# Altium schematic sheet USB_FIFO.SchDoc
size A4; SheetNumber: 3; SheetTotal: 8
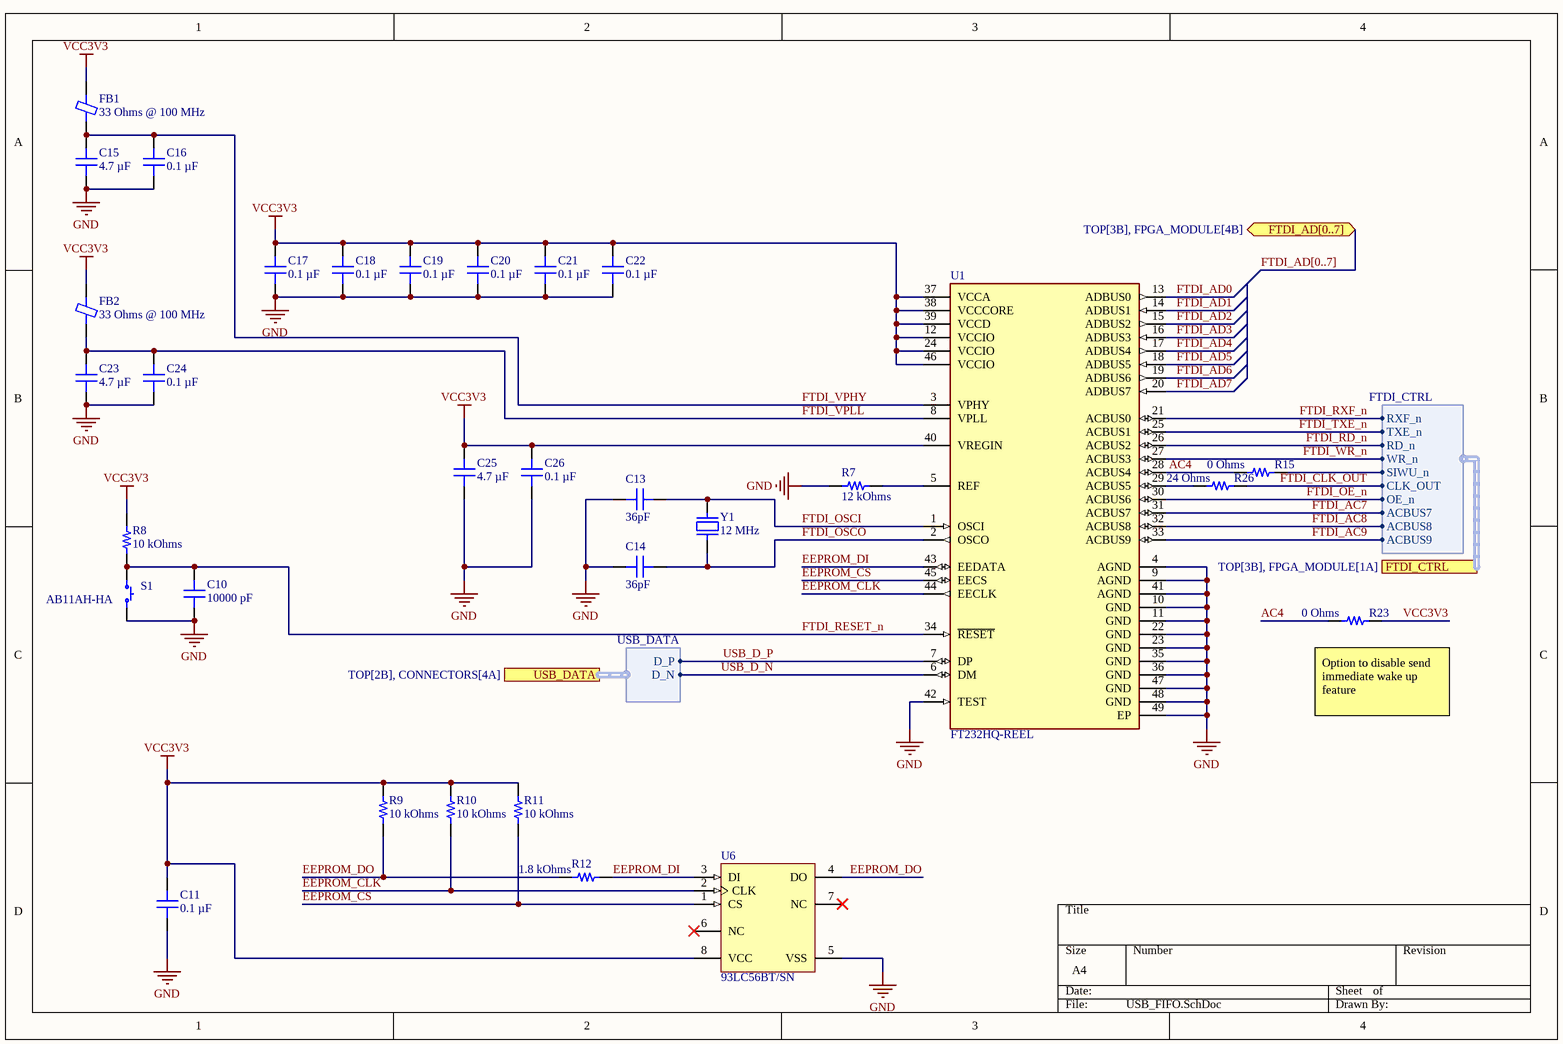
[diagram p0: USB_FIFO.SchDoc]

## Parts
C10  10000 pF  [CAP 0402_1005]
C11  0.1 µF  [CAP 0402_1005]
C13  36pF  [CAP 0603_1608]
C14  36pF  [CAP 0603_1608]
C15  4.7 µF  [CAP 0402_1005]
C16  0.1 µF  [CAP 0402_1005]
C17  0.1 µF  [CAP 0402_1005]
C18  0.1 µF  [CAP 0402_1005]
C19  0.1 µF  [CAP 0402_1005]
C20  0.1 µF  [CAP 0402_1005]
C21  0.1 µF  [CAP 0402_1005]
C22  0.1 µF  [CAP 0402_1005]
C23  4.7 µF  [CAP 0402_1005]
C24  0.1 µF  [CAP 0402_1005]
C25  4.7 µF  [CAP 0402_1005]
C26  0.1 µF  [CAP 0402_1005]
FB1  33 Ohms @ 100 MHz  [FER 0201_0603]
FB2  33 Ohms @ 100 MHz  [FER 0201_0603]
R7  12 kOhms  [RES 0402_1005]
R8  10 kOhms  [RES 0402_1005]
R9  10 kOhms  [RES 0402_1005]
R10  10 kOhms  [RES 0402_1005]
R11  10 kOhms  [RES 0402_1005]
R12  1.8 kOhms  [RES 0402_1005]
R15  0 Ohms  [RES 0603_1608]
R23  0 Ohms  [RES 0603_1608]
R26  24 Ohms  [RES 0402_1005]
S1  AB11AH-HA  [NKK AB11AH-HA]
U1  FT232HQ-REEL  [FP-QFN-48-MFG]
U6  93LC56BT/SN  [SOIC-SN8_M]
Y1  12 MHz  [ABRACON ABLS]

## Ports
FTDI_AD[0..7] (bidir, see TOP[3B], FPGA_MODULE[4B]), FTDI_CTRL (harness FTDI_CTRL, see TOP[3B], FPGA_MODULE[1A]), USB_DATA (harness USB_DATA, see TOP[2B], CONNECTORS[4A])

## Harnesses
USB_DATA: D_N, D_P
FTDI_CTRL: RXF_n, TXE_n, RD_n, WR_n, CLK_OUT, OE_n, ACBUS7, ACBUS8, ACBUS9, SIWU_n

## Nets
GND: C10.1 C11.1 C13.1 C14.1 C15.1 C16.1 C17.1 C18.1 C19.1 C20.1 C21.1 C22.1 C23.1 C24.1 C25.1 C26.1 R7.1 S1.1 U1.4(AGND) U1.9(AGND) U1.10(GND) U1.11(GND) U1.22(GND) U1.23(GND) U1.35(GND) U1.36(GND) U1.41(AGND) U1.42(TEST) U1.47(GND) U1.48(GND) U1.49(EP) U6.5(VSS)
VCC3V3: C11.2 C17.2 C18.2 C19.2 C20.2 C21.2 C22.2 C25.2 C26.2 FB1.2 FB2.2 R8.2 R9.2 R10.2 R11.2 R23.2 U1.12(VCCIO) U1.24(VCCIO) U1.37(VCCA) U1.38(VCCCORE) U1.39(VCCD) U1.40(VREGIN) U1.46(VCCIO) U6.8(VCC)
AC4: R15.1 R23.1 U1.28(ACBUS4)
EEPROM_CLK: R10.1 U1.44(EECLK) U6.2(CLK)
EEPROM_CS: R11.1 U1.45(EECS) U6.1(CS)
EEPROM_DI: R12.2 U1.43(EEDATA) U6.3(DI)
EEPROM_DO: R9.1 R12.1 U6.4(DO)
FTDI_AC7: U1.31(ACBUS7) ; port FTDI_CTRL.ACBUS7
FTDI_AC8: U1.32(ACBUS8) ; port FTDI_CTRL.ACBUS8
FTDI_AC9: U1.33(ACBUS9) ; port FTDI_CTRL.ACBUS9
FTDI_AD0: U1.13(ADBUS0)
FTDI_AD1: U1.14(ADBUS1)
FTDI_AD2: U1.15(ADBUS2)
FTDI_AD3: U1.16(ADBUS3)
FTDI_AD4: U1.17(ADBUS4)
FTDI_AD5: U1.18(ADBUS5)
FTDI_AD6: U1.19(ADBUS6)
FTDI_AD7: U1.20(ADBUS7)
FTDI_CLK_OUT: R26.2 ; port FTDI_CTRL.CLK_OUT
FTDI_OE_n: U1.30(ACBUS6) ; port FTDI_CTRL.OE_n
FTDI_OSCI: C13.2 U1.1(OSCI) Y1.2
FTDI_OSCO: C14.2 U1.2(OSCO) Y1.1
FTDI_RD_n: U1.26(ACBUS2) ; port FTDI_CTRL.RD_n
FTDI_RESET_n: C10.2 R8.1 S1.3 U1.34(~{RESET})
FTDI_RXF_n: U1.21(ACBUS0) ; port FTDI_CTRL.RXF_n
FTDI_TXE_n: U1.25(ACBUS1) ; port FTDI_CTRL.TXE_n
FTDI_VPHY: C15.2 C16.2 FB1.1 U1.3(VPHY)
FTDI_VPLL: C23.2 C24.2 FB2.1 U1.8(VPLL)
FTDI_WR_n: U1.27(ACBUS3) ; port FTDI_CTRL.WR_n
USB_D_N: U1.6(DM) ; port USB_DATA.D_N
USB_D_P: U1.7(DP) ; port USB_DATA.D_P
NetR7_2: R7.2 U1.5(REF)
NetR15_2: R15.2 ; port FTDI_CTRL.SIWU_n
NetR26_1: R26.1 U1.29(ACBUS5)

Not connected (* = marked no-connect by the designer): U6 6(NC)* 7(NC)*

## Buses and harness runs
bus FTDI_AD[0..7] = port FTDI_AD[0..7]

## Notes on the sheet
- (near R23) Option to disable send immediate wake up feature

## Library data of the parts
C10 = HMK105B7103KVHFE: CAP MLCC 0.01UF 100V X7R 0402; manufacturer: Taiyo Yuden; Tolerance: ±10%; Part Number: HMK105B7103KVHFE; Value: 10000 pF; Applications: Automotive, SMPS Filtering; Capacitance: 10000 pF; componentlink1description: Datasheet; componentlink1url: https://ds.yuden.co.jp/TYCOMPAS/ut/detail?pn=HMK105B7103KVHFE&u=M; componentlink2description: DigiKey Link; componentlink2url: https://www.digikey.com/en/products/detail/taiyo-yuden/HMK105B7103KVHFE/11687483; Device Package: 0402 (1005 Metric); lastupdated: 2022-07-15 11:24:57 AM; Lifecycle Status: Active; Minimum Order: 1; Mounting Type: Surface Mount, MLCC; Operating Temperature: -55°C ~ 125°C; Package / Case: 0402 (1005 Metric); packaging: TapeAndReel; partid: 41784; Part Status: Active; price: 0.02; Ratings: AEC-Q200; series: M; Size / Dimension: 0.039" L x 0.020" W (1.00mm x 0.50mm); Supplier 1: DigiKey; Supplier Part Number 1: 587-HMK105B7103KVHFECT-ND; Temperature Coefficient: X7R; Thickness (Max): 0.022" (0.55mm); Voltage - Rated: 100V
C11 C16-C22 C24 C26 = CGA2B3X5R1H104M050BB: CAP CER 0.1UF 50V X5R 0402; manufacturer: TDK Corporation; Tolerance: ±20%; Part Number: CGA2B3X5R1H104M050BB; Value: 0.1 µF; Applications: Automotive; Capacitance: 0.1 µF; componentlink1description: Datasheet; componentlink1url: https://product.tdk.com/info/en/catalog/datasheets/mlcc_automotive_general_en.pdf?ref_disty=digikey; componentlink2description: DigiKey Link; componentlink2url: https://www.digikey.com/en/products/detail/tdk-corporation/CGA2B3X5R1H104M050BB/3949450; Device Package: 0402 (1005 Metric); Lifecycle Status: Active; Minimum Order: 1; Mounting Type: Surface Mount, MLCC; Operating Temperature: -55°C ~ 85°C; Package / Case: 0402 (1005 Metric); packaging: TapeAndReel; partid: 1792; Part Status: Active; price: 0.02; Ratings: AEC-Q200; series: CGA; Size / Dimension: 0.039" L x 0.020" W (1.00mm x 0.50mm); Supplier 1: DigiKey; Supplier Part Number 1: 445-12214-1-ND; Temperature Coefficient: X5R; Thickness (Max): 0.022" (0.55mm); Voltage - Rated: 50V
  C11: lastupdated: 2022-07-15 11:25:55 AM
  C16-C22 C24 C26: lastupdated: 2022-07-21 3:55:54 AM
C13 C14 = 06031A360JAT2A: CAP CER 36PF 100V NP0 0603; manufacturer: AVX Corporation; Temperature Coefficient: C0G, NP0; Tolerance: ±5%; Part Number: 06031A360JAT2A; Value: 36pF; Applications: General Purpose; Capacitance: 36pF; componentlink1description: Datasheet; componentlink1url: http://datasheets.avx.com/C0GNP0-Dielectric.pdf; componentlink2description: DigiKey Link; componentlink2url: http://digikey.com/product-detail/en/avx-corporation/06031A360JAT2A/478-10202-1-ND/6797206; Device Package: 0603 (1608 Metric); lastupdated: 2020-09-02 1:03:27 AM; Lifecycle Status: Active; Minimum Order: 1; Mounting Type: Surface Mount, MLCC; Operating Temperature: -55°C ~ 125°C; Package / Case: 0603 (1608 Metric); packaging: TapeAndReel; partid: 7331; Part Status: Active; price: 0.04; series: -; Size / Dimension: 0.063" L x 0.032" W (1.60mm x 0.81mm); Supplier 1: DigiKey; Supplier Part Number 1: 478-10202-1-ND; Thickness (Max): 0.035" (0.90mm); Voltage - Rated: 100V
C15 C23 C25 = CL05A475MO5NUNC: CAP CER 4.7UF 16V X5R 0402; manufacturer: Samsung Electro-Mechanics; Tolerance: ±20%; Part Number: CL05A475MO5NUNC; Value: 4.7 µF; Applications: General Purpose; Capacitance: 4.7 µF; componentlink1description: Datasheet; componentlink1url: http://www.samsungsem.com/kr/support/product-search/mlcc/__icsFiles/afieldfile/2019/05/29/Data%20sheet_CL05A475MO5NUNC.pdf; componentlink2description: DigiKey Link; componentlink2url: https://www.digikey.com/en/products/detail/samsung-electro-mechanics/CL05A475MO5NUNC/5961320; Device Package: 0402 (1005 Metric); lastupdated: 2022-07-21 3:55:55 AM; Lifecycle Status: Active; Minimum Order: 1; Mounting Type: Surface Mount, MLCC; Operating Temperature: -55°C ~ 85°C; Package / Case: 0402 (1005 Metric); packaging: TapeAndReel; partid: 1760; Part Status: Active; price: 0.09; series: CL; Size / Dimension: 0.039" L x 0.020" W (1.00mm x 0.50mm); Supplier 1: DigiKey; Supplier Part Number 1: 1276-6836-1-ND; Temperature Coefficient: X5R; Thickness (Max): 0.028" (0.70mm); Voltage - Rated: 16V
FB1 FB2 = MMZ0603F330CT000: FERRITE BEAD 33 OHM 0201 1LN; Manufacturer: TDK Corporation; Current Rating (Max): 150mA; DC Resistance (DCR) (Max): 1.3Ohm; Filter Type: Signal Line; Number of Lines: 1; Part Number: MMZ0603F330CT000; ComponentLink1Description: Datasheet; ComponentLink1URL: https://product.tdk.com/info/en/catalog/datasheets/beads_commercial_signal_mmz0603_en.pdf?ref_disty=digikey; ComponentLink2Description: DigiKey Link; ComponentLink2URL: https://www.digikey.com/en/products/detail/tdk-corporation/MMZ0603F330CT000/2747662; Device Package: 0201 (0603 Metric); Height (Max): 0.013" (0.33mm); Impedance @ Frequency: 33 Ohms @ 100 MHz; LastUpdated: 2022-07-21 4:37:41 AM; Lifecycle Status: Active; Minimum Order: 1; Mounting Type: Surface Mount; Operating Temperature: -55°C ~ 125°C; Package / Case: 0201 (0603 Metric); Packaging: TapeAndReel; PartId: 1; Part Status: Active; Price: 0.03; Series: MMZ; Size / Dimension: 0.024" L x 0.012" W (0.60mm x 0.30mm); Supplier 1: DigiKey; Supplier Part Number 1: 445-7792-1-ND; Value: 33 Ohms @ 100 MHz
R7 = CPF0402B12KE1: RES SMD 12K OHM 0.1% 1/16W 0402; Manufacturer: TE Connectivity Passive Product; Power (Watts): 0.063W, 1/16W; Temperature Coefficient: ±25ppm/°C; Part Number: CPF0402B12KE1; Value: 12 kOhms; ComponentLink1Description: Datasheet; ComponentLink1URL: https://www.te.com/commerce/DocumentDelivery/DDEController?Action=srchrtrv&DocNm=1773200&DocType=DS&DocLang=English; ComponentLink2Description: DigiKey Link; ComponentLink2URL: https://www.digikey.com/en/products/detail/te-connectivity-passive-product/CPF0402B12KE1/2381830; Composition: Thin Film; Device Package: 0402 (1005 Metric); Height - Seated (Max): 0.014" (0.35mm); LastUpdated: 2022-07-15 11:43:11 AM; Lifecycle Status: Active; Minimum Order: 1; Number of Terminations: 2; Operating Temperature: -55°C ~ 155°C; Package / Case: 0402 (1005 Metric); Packaging: TapeAndReel; PartId: 3318; Part Status: Active; Price: 0.15; Resistance: 12 kOhms; Series: CPF, Neohm; Size / Dimension: 0.039" L x 0.020" W (1.00mm x 0.50mm); Supplier 1: DigiKey; Supplier Part Number 1: A102603CT-ND; Supplier Device Package: 0402; Tolerance: ±0.1%
R8-R11 = RP73PF1E10KBTD: RES 10K OHM 0.1% 1/10W 0402; Manufacturer: TE Connectivity Passive Product; Power (Watts): 0.1W, 1/10W; Temperature Coefficient: ±25ppm/°C; Part Number: RP73PF1E10KBTD; Value: 10 kOhms; ComponentLink1Description: Datasheet; ComponentLink1URL: https://www.te.com/commerce/DocumentDelivery/DDEController?Action=srchrtrv&DocNm=1773272&DocType=DS&DocLang=English; ComponentLink2Description: DigiKey Link; ComponentLink2URL: https://www.digikey.com/en/products/detail/te-connectivity-passive-product/RP73PF1E10KBTD/8260957; Composition: Thin Film; Device Package: 0402 (1005 Metric); Height - Seated (Max): 0.014" (0.35mm); LastUpdated: 2022-07-15 11:43:14 AM; Lifecycle Status: Active; Minimum Order: 1; Number of Terminations: 2; Operating Temperature: -55°C ~ 155°C; Package / Case: 0402 (1005 Metric); Packaging: TapeAndReel; PartId: 2434; Part Status: Active; Price: 0.09; Resistance: 10 kOhms; Series: RP73, Holsworthy; Size / Dimension: 0.039" L x 0.020" W (1.00mm x 0.50mm); Supplier 1: DigiKey; Supplier Part Number 1: A127415CT-ND; Supplier Device Package: 0402; Tolerance: ±0.1%
R12 = RC0402FR-071K8L: RES 1.8K OHM 1% 1/16W 0402; Manufacturer: Yageo; Power (Watts): 0.063W, 1/16W; Temperature Coefficient: ±100ppm/°C; Part Number: RC0402FR-071K8L; Value: 1.8 kOhms; ComponentLink1Description: Datasheet; ComponentLink1URL: https://www.yageo.com/upload/media/product/productsearch/datasheet/rchip/PYu-RC_Group_51_RoHS_L_10.pdf; ComponentLink2Description: DigiKey Link; ComponentLink2URL: https://www.digikey.com/en/products/detail/yageo/RC0402FR-071K8L/726520; Composition: Thick Film; Device Package: 0402 (1005 Metric); Features: Moisture Resistant; Height - Seated (Max): 0.016" (0.40mm); LastUpdated: 2022-07-21 4:11:16 AM; Lifecycle Status: Active; Minimum Order: 1; Number of Terminations: 2; Operating Temperature: -55°C ~ 155°C; Package / Case: 0402 (1005 Metric); Packaging: CutTape; PartId: 2542; Part Status: Active; Price: 0.01; Resistance: 1.8 kOhms; Series: RC_L; Size / Dimension: 0.039" L x 0.020" W (1.00mm x 0.50mm); Supplier 1: DigiKey; Supplier Part Number 1: 311-1.80KLRCT-ND; Supplier Device Package: 0402; Tolerance: ±1%
R15 R23 = 5110: RES SMD 0 OHM JUMPER 1/2W 0603; Part Number: 5110; Manufacturer: Keystone Electronics; Power (Watts): 0.5W, 1/2W; Value: 0 Ohms; ComponentLink1Description: Datasheet; ComponentLink1URL: http://keyelco.com/userAssets/file/M65p54.pdf; ComponentLink2Description: DigiKey Link; ComponentLink2URL: https://www.digikey.com/en/products/detail/keystone-electronics/5110/5118870; Composition: Metal Element; Device Package: 0603 (1608 Metric); Height - Seated (Max): 0.028" (0.70mm); LastUpdated: 2022-09-14 8:08:57 AM; Lifecycle Status: Active; Minimum Order: 1; Number of Terminations: 2; Package / Case: 0603 (1608 Metric); Packaging: TapeAndReel; PartId: 20779; Part Status: Active; Price: 0.16; Resistance: 0 Ohms; Series: -; Size / Dimension: 0.061" L x 0.033" W (1.55mm x 0.85mm); Supplier 1: DigiKey; Supplier Part Number 1: 36-5110CT-ND; Supplier Device Package: 0603; Tolerance: Jumper
R26 = RC0402FR-0724RL: RES 24 OHM 1% 1/16W 0402; Manufacturer: Yageo; Power (Watts): 0.063W, 1/16W; Temperature Coefficient: ±100ppm/°C; Part Number: RC0402FR-0724RL; Value: 24 Ohms; ComponentLink1Description: Datasheet; ComponentLink1URL: https://www.yageo.com/upload/media/product/productsearch/datasheet/rchip/PYu-RC_Group_51_RoHS_L_10.pdf; ComponentLink2Description: DigiKey Link; ComponentLink2URL: https://www.digikey.com/en/products/detail/yageo/RC0402FR-0724RL/5280933; Composition: Thick Film; Device Package: 0402 (1005 Metric); Features: Moisture Resistant; Height - Seated (Max): 0.016" (0.40mm); LastUpdated: 2022-09-19 1:15:03 PM; Lifecycle Status: Active; Minimum Order: 1; Number of Terminations: 2; Operating Temperature: -55°C ~ 155°C; Package / Case: 0402 (1005 Metric); Packaging: CutTape; PartId: 2811; Part Status: Active; Price: 0.01; Resistance: 24 Ohms; Series: RC_L; Size / Dimension: 0.039" L x 0.020" W (1.00mm x 0.50mm); Supplier 1: DigiKey; Supplier Part Number 1: YAG3073CT-ND; Supplier Device Package: 0402; Tolerance: ±1%
S1 = AB11AH-HA: SWITCH PUSH SPST-NO 0.4VA 28V; Manufacturer: NKK Switches; Actuator Type: Round, Button; Color - Actuator/Cap: Black; Current Rating (Amps): 0.4VA (AC/DC); Switch Function: Off-Mom; Part Number: AB11AH-HA; Circuit: SPST-NO; ComponentLink1Description: Datasheet; ComponentLink1URL: https://www.nkkswitches.com/pdf/Apushbuttons.pdf; ComponentLink2Description: DigiKey Link; ComponentLink2URL: //digikey.com/product-detail/en/nkk-switches/AB11AH-HA/360-2703-ND/1056050; Features: Sealed - Fully; LastUpdated: 2019-12-12 8:13:11 AM; Lifecycle Status: 0; Minimum Order: 1; Mounting Type: Through Hole, Right Angle; Operating Temperature: -30°C ~ 85°C; Packaging: Tray; Part Status: Active; Price: 5.00; Series: AB; Supplier 1: DigiKey; Supplier Part Number 1: 360-2703-ND; Termination Style: PC Pin; Type: Standard; Voltage Rating - AC: 28V; Voltage Rating - DC: 28V
U1 = CMP-0078-00034-4: IC HS USB TO UART/FIFO 48QFN; Number of Channels: 1; Max Supply Voltage: 3.63V; Min Supply Voltage: 2.97V; Operating Supply Current: 24mA; Data Rate: 12Mbps; Interface: UART; Nominal Supply Current: 60mA; Operating Supply Voltage: 3.3V; Case/Package: QFN; Packaging: Tape and Reel; Weight: 0.005309oz; Number of Pins: 48; REACH SVHC: No SVHC; Length: 7mm; Mount: Surface Mount; Package Quantity: 1; Lead Free: Lead Free; Radiation Hardening: No; Max Operating Temperature: 85°C; Min Operating Temperature: -40°C; Height: 1.4mm; Width: 7mm
U6 = CMP-0162-00132-1: 2K, 128x16-bit, 2.5V Microwire Serial EEPROM, 8-Pin SOIC 150mil, Commercial Temperature, Tape and Reel; ComponentAvailability: Unknown. Contact manufacturer to determine status.; Code_IPC: SOIC127P600-8; PackageReference: SOIC-SN8; Code_JEDEC: MS-012; DatasheetVersion: revF, May-2008; PackageDescription: 8-Lead Plastic Small Outline (SN) - Narrow, 3.90mm Body [SOIC]; PackageVersion: revBB, Aug-2009
Y1 = ABLS-12.000MHZ-20-B-3-H-T: CRYSTAL 12.0000MHZ 20PF SMD; Manufacturer: Abracon LLC; ESR (Equivalent Series Resistance): 50 Ohms; Frequency Stability: ±35ppm; Frequency Tolerance: ±25ppm; Operating Mode: Fundamental; Part Number: ABLS-12.000MHZ-20-B-3-H-T; ComponentLink1Description: Datasheet; ComponentLink1URL: https://abracon.com/Resonators/abls.pdf; ComponentLink2Description: DigiKey Link; ComponentLink2URL: https://www.digikey.com/en/products/detail/abracon-llc/ABLS-12-000MHZ-20-B-3-H-T/9997914; Frequency: 12 MHz; Height - Seated (Max): 0.165" (4.20mm); LastUpdated: 2022-07-21 4:44:16 AM; Lifecycle Status: Active; Load Capacitance: 20pF; Minimum Order: 1; Mounting Type: Surface Mount; Operating Temperature: -20°C ~ 70°C; Package / Case: HC-49/US; Packaging: TapeAndReel; PartId: 124; Part Status: Active; Price: 0.09; Series: ABLS; Size / Dimension: 0.449" L x 0.185" W (11.40mm x 4.70mm); Supplier 1: DigiKey; Supplier Part Number 1: 535-15006-1-ND; Type: MHz Crystal; Value: 12 MHz